# EAGLE design EAT0001 (EAGLE 7.2.0)
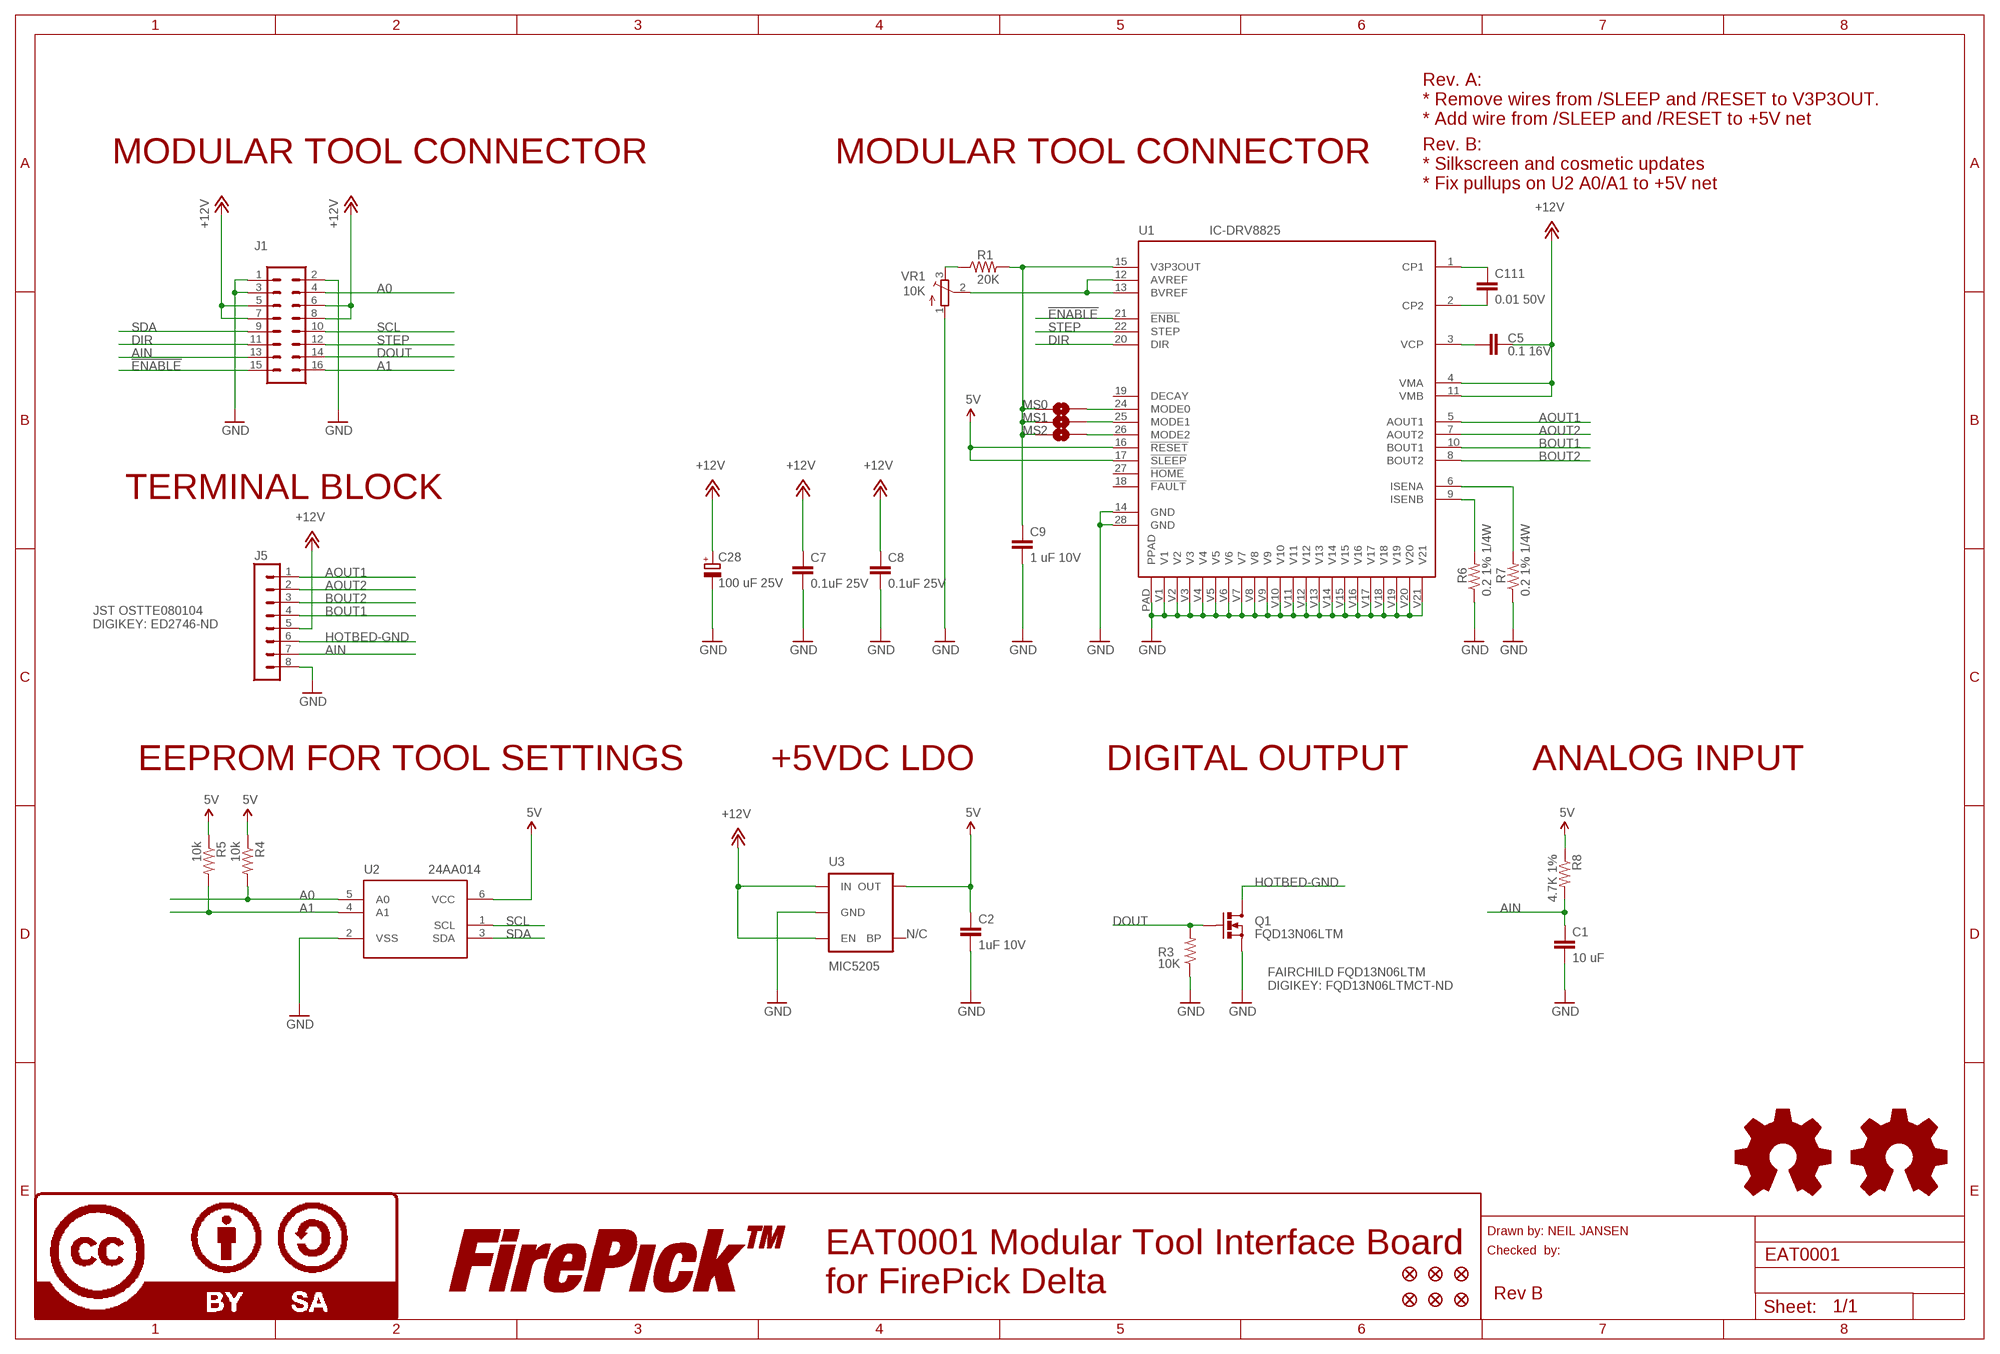
[diagram p0: schematic, sheet 1]

## Parts
C1  10 uF  CAP0805  [0805]
C2  1uF 10V  CAP0805  [0805]
C5  0.1 16V  CAP0805  [0805]
C7  0.1uF 25V  CAP0805  [0805]
C8  0.1uF 25V  CAP0805  [0805]
C9  1 uF 10V  CAP0805  [0805]
C28  100 uF 25V  CPOL-EUUD-6,3X7,7  [UD-6,3X7,7_NICHICON]
C111  0.01 50V  CAP0805  [0805]
FID1  FIDUCIAL1X2  [FIDUCIAL-1X2]
FID2  FIDUCIAL1X2  [FIDUCIAL-1X2]
FID3  FIDUCIAL1X2  [FIDUCIAL-1X2]
FID4  FIDUCIAL1X2  [FIDUCIAL-1X2]
FID5  FIDUCIAL1X2  [FIDUCIAL-1X2]
FID6  FIDUCIAL1X2  [FIDUCIAL-1X2]
J1  CONN-RECT-16PIN-2ROWSIDE  [CONN-RECT-2.54MM-16PIN-2ROW-SIDE]
J5  CONN-OSTTE1201X4  [CONN-OSTTE1201X4]
LOGO1  LOGO-OSHWSMALL  [LOGO-OSHW-SMALL]
LOGO4  LOGO-FIREPICKMEDIUM  [LOGO-FIREPICK-MEDIUM]
LOGO5  LOGO-OSHWSMALL  [LOGO-OSHW-SMALL]
LOGO6  LOGO-CC-BY-SAMEDIUM  [LOGO-CC-BY-SA-MEDIUM]
MS0  JUMPER  [JUMPER-NC]
MS1  JUMPER  [JUMPER-NC]
MS2  JUMPER  [JUMPER-NC]
Q1  FQD13N06LTM  MOSFET-NCHANNELFDD8580  [DPAK]
R1  20K  RESISTOR0805-RES  [0805]
R3  10K  RESISTOR0805-RES  [0805]
R4  10k  RESISTOR0805-RES  [0805]
R5  10k  RESISTOR0805-RES  [0805]
R6  0.2 1% 1/4W  RESISTOR0805-RES  [0805]
R7  0.2 1% 1/4W  RESISTOR0805-RES  [0805]
R8  4.7K 1%  RESISTOR0805-RES  [0805]
U1  IC-DRV8825  [TSSOP28_PAD]
U2  24AA014  IC-24AA014  [SOT23-6]
U3  MIC5205  MIC52055V  [SOT23-5]
VR1  10K  TRIMPOTTC33X  [TC33X]

## Nets
5V [power]: C2.1 R4.1 R5.1 R8.1 U1.16(!RESET) U1.17(!SLEEP) U2.6(VCC) U3.5(OUT)
!ENABLE: J1.15 U1.21(!ENBL)
+12V [power-12V]: C5.1 C7.1 C8.1 C28.+ J1.5 J1.6 J1.7 J1.8 J5.5 U1.4(VMA) U1.11(VMB) U3.1(IN) U3.3(EN)
A0: J1.4 R4.2 U2.5(A0)
A1: J1.16 R5.2 U2.4(A1)
AIN: C1.1 J1.13 J5.7 R8.2
AOUT1: J5.1 U1.5(AOUT1)
AOUT2: J5.2 U1.7(AOUT2)
BOUT1: J5.4 U1.10(BOUT1)
BOUT2: J5.3 U1.8(BOUT2)
CP1: C111.1 U1.1(CP1)
CP2: C111.2 U1.2(CP2)
DIR: J1.11 U1.20(DIR)
DOUT: J1.14 Q1.1(G) R3.2
GND: C1.2 C2.2 C7.2 C8.2 C9.2 C28.- J1.1 J1.2 J1.3 J5.8 Q1.3(S) R3.1 R6.1 R7.1 U1.14(GND) U1.28(GND) U1.PAD U1.V1 U1.V2 U1.V3 U1.V4 U1.V5 U1.V6 U1.V7 U1.V8 U1.V9 U1.V10 U1.V11 U1.V12 U1.V13 U1.V14 U1.V15 U1.V16 U1.V17 U1.V18 U1.V19 U1.V20 U1.V21 U2.2(VSS) U3.2(GND) VR1.1(A)
HOTBED-GND [power-12V]: J5.6 Q1.4(D)
ISENA: R7.2 U1.6(ISENA)
ISENB: R6.2 U1.9(ISENB)
MOD1: MS1.2 U1.25(MODE1)
MODE0: MS0.2 U1.24(MODE0)
MODE2: MS2.2 U1.26(MODE2)
N$3: R1.1 VR1.3(E)
SCL: J1.10 U2.1(SCL)
SDA: J1.9 U2.3(SDA)
STEP: J1.12 U1.22(STEP)
V3P3OUT [power]: C9.1 MS0.1 MS1.1 MS2.1 R1.2 U1.15(V3P3OUT)
VCP: C5.2 U1.3(VCP)
VREF: U1.12(AVREF) U1.13(BVREF) VR1.2(S)
Unconnected: U1.18(!FAULT) U1.19(DECAY) U1.27(!HOME) U3.4(BP)

## Notes on the sheet
- Rev. A: 
  * Remove wires from /SLEEP and /RESET to V3P3OUT.
  * Add wire from /SLEEP and /RESET to +5V net
- MODULAR TOOL CONNECTOR | MODULAR TOOL CONNECTOR
- Rev. B: 
  * Silkscreen and cosmetic updates
  * Fix pullups on U2 A0/A1 to +5V net
- TERMINAL BLOCK
- JST OSTTE080104
  DIGIKEY: ED2746-ND
- EEPROM FOR TOOL SETTINGS | +5VDC LDO | DIGITAL OUTPUT | ANALOG INPUT
- N/C
- FAIRCHILD FQD13N06LTM
  DIGIKEY: FQD13N06LTMCT-ND
- Drawn by: NEIL JANSEN
- Checked  by:
- EAT0001 Modular Tool Interface Board
  for FirePick Delta
- Rev B

## Library data of the parts
C1 C2 C5 C7-C9 C111 = SparkFun-Capacitors:CAP: Capacitor Standard 0603 ceramic capacitor, and 0.1" leaded capacitor.
C28 = rcl:CPOL-EU: POLARIZED CAPACITOR, European symbol
FID1-FID6 = SparkFun-Aesthetics:FIDUCIAL: Fiducial Alignment Points Various fiducial points for machine vision alignment.
J1 = FirePick:CONN-RECT-16PIN-2ROW
J5 = FirePick:CONN-OSTTE1201X4
LOGO1 LOGO5 = FirePick:LOGO-OSHW
LOGO4 = FirePick:LOGO-FIREPICK
LOGO6 = FirePick:LOGO-CC-BY-SA
MS0 MS1 MS2 = FirePick:JUMPER
Q1 = SparkFun:MOSFET-NCHANNEL
R1 R3-R8 = SparkFun-Resistors:RESISTOR: Resistor Basic schematic elements and footprints for 0603, 1206, and PTH resistors.
U1 = FirePick:IC-DRV8825
U2 = FirePick:IC-24AA014
U3 = SparkFun-PowerIC:MIC5205: MIC5205 150mA vreg 3.3V - VREG-00822 5V - VREG-00823; PROD_ID: VREG-00823
VR1 = adafruit:TRIMPOT: SMT trimmer potentiometer part number TC33X http://www.ladyada.net/library/eagle

## Net classes
0 default: width 0.3 mm, drill 0.3 mm, clearance 0.3 mm
1 power: width 0.3 mm, drill 0.3 mm, clearance 0.3 mm
2 power-12V: width 0.3 mm, drill 0.3 mm, clearance 0.3 mm

## Board
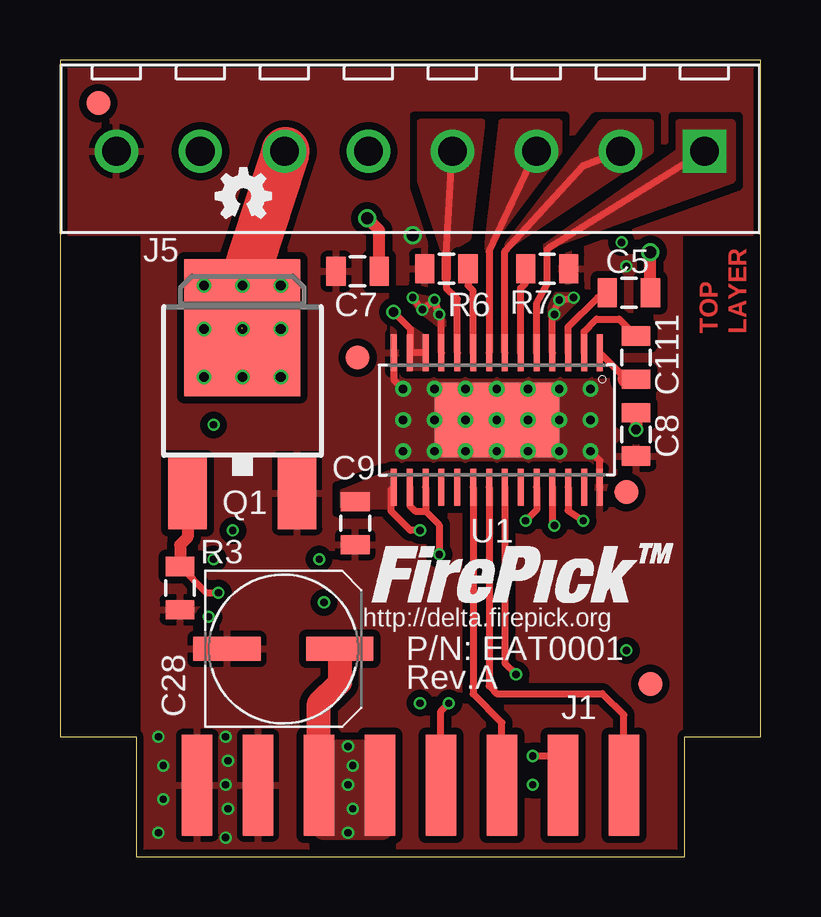
[diagram p1: board, top side]
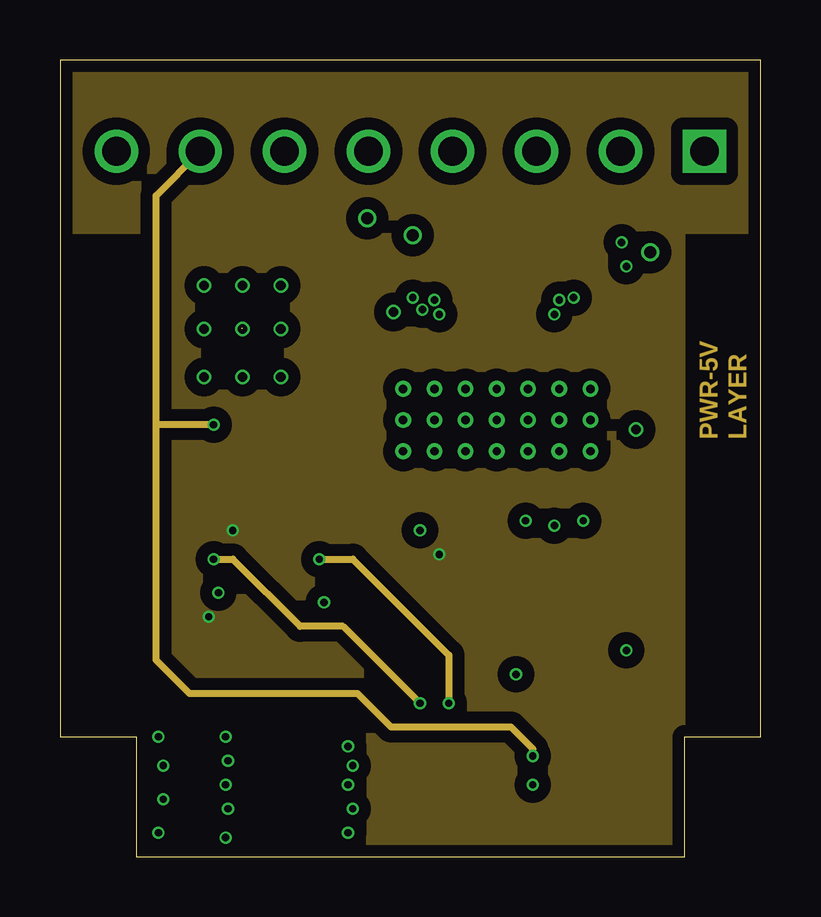
[diagram p2: board, inner layer PWR-5v]
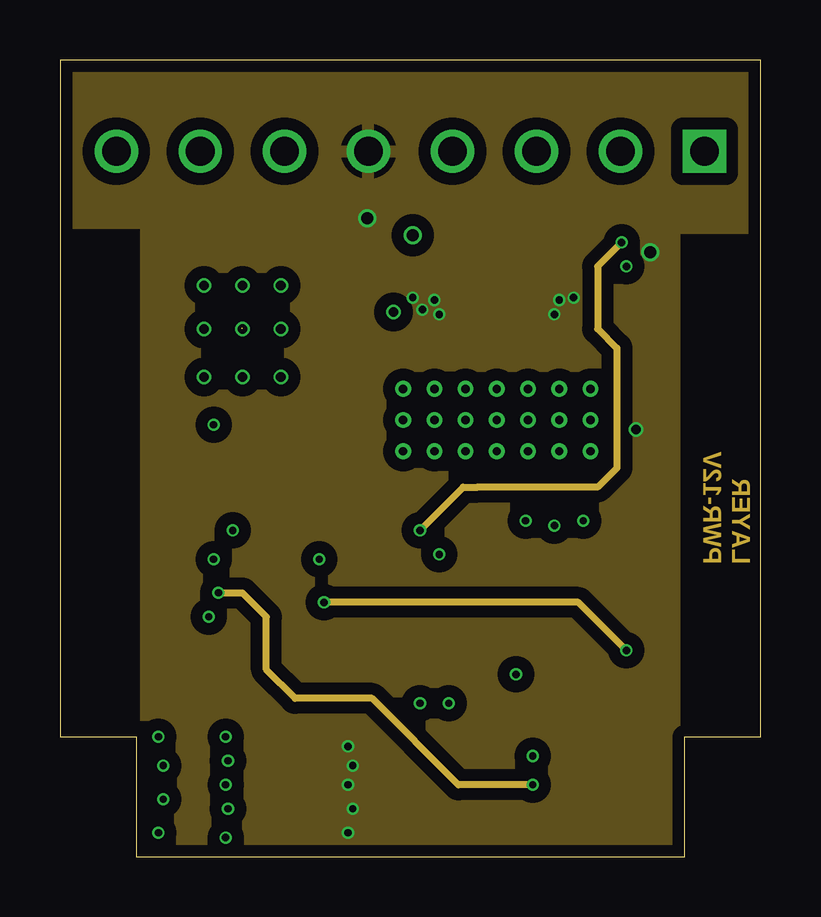
[diagram p3: board, inner layer PWR-12V]
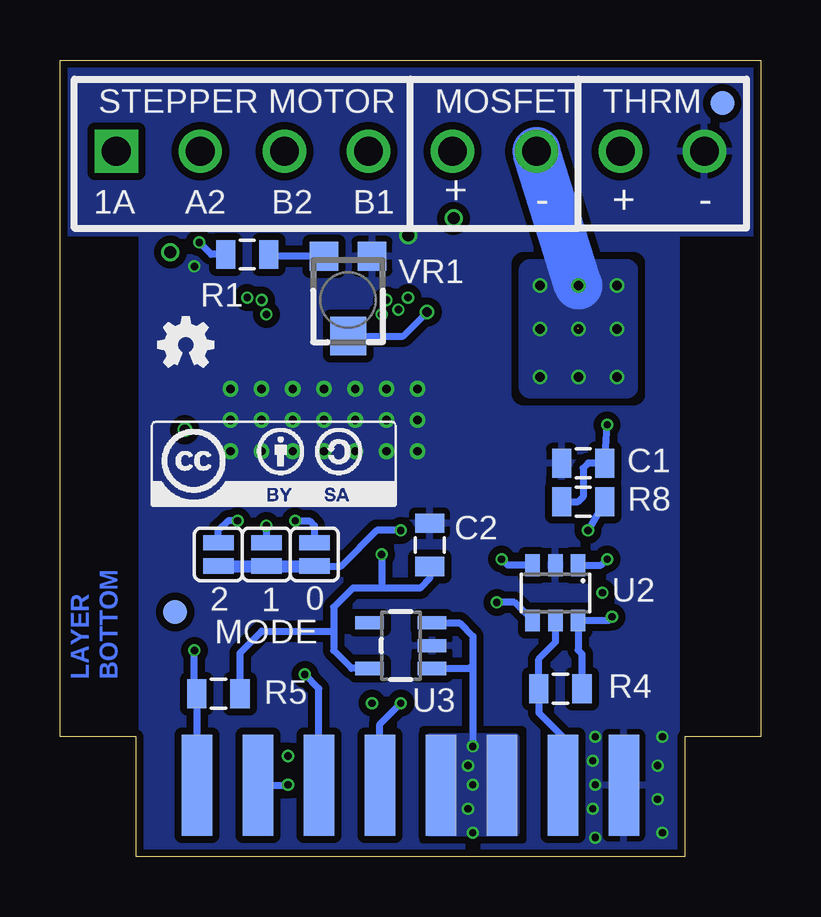
[diagram p4: board, bottom side, seen from below]

Size 29.2 x 33.2 mm. Coordinates in mm from the lower left corner, seen from the top.
Outline: 3.17,0 26.03,0 26.03,5 29.2,5 29.2,33.2 0,33.2 0,5 3.17,5 3.17,0
Copper layers (1*2*15*16): Top 0.035mm / dielectric 0.2mm / PWR-5v 0.0175mm / dielectric 0.3mm / PWR-12V 0.0175mm / dielectric 0.2mm / Bottom 0.035mm
Design rules "SeeedStudio_4layer_DRU_no_angle_20140221": minimum track width 8mil, minimum drill 12mil, track to track 8mil, track to pad 8mil, pad to pad 8mil, via to via 8mil, smd to smd 0mil, copper to edge 10mil, drill to drill 8mil, minimum pad ring 6mil, minimum via ring 4mil, stop-mask expansion 4mil, vias tented up to drill 100mil, thermal gap 10mil

### Footprints (pad centres in the part's own frame; a part is rotated, then mirrored left to right if it is on the bottom)
0805 = smd 0.8 x 1.2: 1 -0.9,0; 2 0.9,0
UD-6,3X7,7_NICHICON = smd 2.8 x 1: + 2.35,0; - -2.35,0
FIDUCIAL-1X2 = smd 1 x 1: 1 0,0
CONN-RECT-2.54MM-16PIN-2ROW-SIDE = smd 1.27 x 4.2: 1 -8.89,-0.02; 3 -6.35,-0.02; 5 -3.81,-0.02; 7 -1.27,-0.02; 9 1.27,-0.02; 11 3.81,-0.02; 13 6.35,-0.02; 15 8.89,-0.02 | smd 1.27 x 4.2 bottom: 2 -8.89,-0.02; 4 -6.35,-0.02; 6 -3.81,-0.02; 8 -1.27,-0.02; 10 1.27,-0.02; 12 3.81,-0.02; 14 6.35,-0.02; 16 8.89,-0.02
CONN-OSTTE1201X4 = drill 1.2 square: 1 -12.25,0 | drill 1.2: 2 -8.75,0; 3 -5.25,0; 4 -1.75,0; 5 1.75,0; 6 5.25,0; 7 8.75,0; 8 12.25,0
JUMPER-NC = smd 0.635 x 1.27: 1 -0.487,0; 2 0.487,0
DPAK = smd 1.6 x 3: 1 -2.28,-5.31; 3 2.28,-5.31 | smd 4.826 x 5.715: 4 0,1.588
TSSOP28_PAD = smd 1.55 x 0.25: 1 -2.8,4.298; 2 -2.8,3.637; 3 -2.8,2.977; 4 -2.8,2.317; 5 -2.8,1.656; 6 -2.8,0.996; 7 -2.8,0.335; 8 -2.8,-0.325; 9 -2.8,-0.985; 10 -2.8,-1.646; 11 -2.8,-2.306; 12 -2.8,-2.967; 13 -2.8,-3.627; 14 -2.8,-4.287; 15 2.8,-4.287; 16 2.8,-3.627; 17 2.8,-2.967; 18 2.8,-2.306; 19 2.8,-1.646; 20 2.8,-0.985; 21 2.8,-0.325; 22 2.8,0.335; 23 2.8,0.996; 24 2.8,1.656; 25 2.8,2.317; 26 2.8,2.977; 27 2.8,3.637; 28 2.8,4.298 | smd 3.1 x 5.18: PAD 0,0.005 | drill 0.35 pad 0.6: V1 -1.3,3.9; V2 0,3.9; V3 1.3,3.9; V4 -1.3,2.6; V5 0,2.6; V6 1.3,2.6; V7 -1.3,1.3; V8 0,1.3; V9 1.3,1.3; V10 -1.3,0; V11 0,0; V12 1.3,0; V13 -1.3,-1.3; V14 0,-1.3; V15 1.3,-1.3; V16 -1.3,-2.6; V17 0,-2.6; V18 1.3,-2.6; V19 -1.3,-3.9; V20 0,-3.9; V21 1.3,-3.9
SOT23-6 = smd 0.6 x 0.9: 1 -0.95,-1.15; 2 0,-1.15; 3 0.95,-1.15; 4 0.95,1.15; 5 0,1.15; 6 -0.95,1.15
SOT23-5 = smd 0.55 x 1.2: 1 -0.95,-1.3; 2 0,-1.3; 3 0.95,-1.3; 4 0.95,1.3; 5 -0.95,1.3
TC33X = smd 1.2 x 1.2: 1 -1,-1.825; 3 1,-1.825 | smd 1.5 x 1.6: 2 0,1.5

### Placement (x,y rotation side)
C1  7.4,16.4 180 bottom
C2  13.8,13 90 bottom
C5  23.7,23.5 180 top
C7  12.4,24.4 180 top
C8  24,17.6 270 top
C9  12.3,13.9 270 top
C28  9.31,8.66 0 top
C111  24,20.8 90 top
FID1  23.6,15.2 0 top
FID2  12.4,20.8 0 top
FID3  1.6,31.4 0 top
FID4  24.6,7.2 90 top
FID5  24.4,10.2 0 bottom
FID6  1.6,31.4 0 bottom
J1  14.6,3 0 top
J5  14.6,29.4 180 top
LOGO1  6.4,26.4 0 top
LOGO4  13,10.6 0 top
LOGO5  25.2,20.2 0 bottom
LOGO6  25.4,14.6 0 bottom
MS0  18.6,12.6 90 bottom
MS1  20.6,12.6 90 bottom
MS2  22.6,12.6 90 bottom
Q1  7.6,20.46 0 top
R1  21.4,25.1 180 bottom
R3  5,11.2 90 top
R4  8.35,7 180 bottom
R5  22.6,6.8 180 bottom
R6  16.1,24.5 0 top
R7  20.3,24.5 180 top
R8  7.4,14.8 180 bottom
U1  18.2,18.2 270 top
U2  8.56,11 180 bottom
U3  15,8.8 90 bottom
VR1  17.2,23.2 180 bottom

### Tracks (layer width: path | path; a pad name or v marks a point on that pad's centre or on a via)
5V  (via drill 0.3)
  Top 0.3: v15.8,12.6 15.8,13.83 15.23,14.4 | U1.17 15.23,14.4 | U1.16 14.57,14.63 14.8,14.4 15.23,14.4
  Bottom 0.3: R8.1 v7.2,13.6 | C2.1 13.8,11.6 14.2,11.2 15.8,11.2 | 15.8,11.2 17,11.2 17.8,10.4 17.8,9.45 | 17.8,9.45 17.8,8.6 17.05,7.85 U3.5 | v6.2,10 6.35,9.85 U2.6 7.61,8.61 7.45,8.45 R4.1 | v15.8,12.6 15.8,11.2 | R5.1 21.7,8.5 20.8,9.4 17.85,9.4 17.8,9.45
  pour PWR-5v (isolate 0.5): 0.2,33 29,33 29,26.2 25.8,26.2 25.8,0 3.4,0 3.4,26.2 0.2,26.2
!ENABLE
  Top 0.3: U1.21 17.88,7.12 18.2,6.8 22.6,6.8 23.49,5.91 J1.15
+12V  (via drill 0.3, 0.4, 0.5)
  Top 0.3: U1.11 15.89,22.51 v15.8,22.6 v15.6,23.2 v15.1,22.8 v14.7,23.3 | U1.4 20.52,22.52 v20.8,23.2 v21.4,23.3
  Top 0.5: C5.1 v24.6,25.2 | C7.1 13.3,26.1 v12.8,26.6 | C8.1 v24,17.8
  Top 1: J1.6 10.79,6.39 11.66,7.26 C28.+
  Bottom 0.3: U3.3 12.55,9.75 12,9.2 12,8 | 12,8 v12,4.6 | U3.1 12.15,7.85 12,8
  other vias: 12,3 12.2,2 12,1 12.2,3.8 20.6,22.6
  pour Top (isolate 0.3, no thermals): 11,4.4 13.4,4.4 13.4,1.2 11,1.2
  pour PWR-12V (isolate 0.5, rank 2): 0.2,33 29,33 29,26.2 25.6,26.2 25.6,0.2 3.6,0.2 3.6,26.4 0.2,26.4
  pour Bottom (no thermals): 10.2,5 13.8,5 13.8,1 10.2,1
  pour Top (no thermals): 14.6,23.4 15.6,23.2 16,22.2 15.8,22.2 15,22.8
  pour Top (no thermals): 20.6,23.4 21.4,23.4 21.6,23 20.6,22.4 20.4,22.6
A0
  Bottom 0.3: J1.4 8.25,5 9.25,6 R4.2 9.25,8.25 8.56,8.94 U2.5
A1  (via drill 0.3)
  PWR-12V 0.3: v23.6,8.6 21.6,10.6 v11,10.6
  Bottom 0.3: J1.16 R5.2 23.6,6.9 v23.6,8.6 | U2.4 10.26,10.6 v11,10.6
AIN  (via drill 0.3)
  Top 0.3: J1.13 20.95,4.15 21,4.2 v19.7,4.2
  PWR-5v 0.3: 4,18 4,8.2 5.4,6.8 12.4,6.8 13.8,5.4 18.8,5.4 19.7,4.5 v19.7,4.2 | 4,18 4,27.55 J5.7 | v6.4,18 4,18
  Bottom 0.3: R8.2 7.6,14.8 7.4,15 7.4,16.2 7.2,16.4 C1.1 v6.4,18
AOUT1
  Top 0.3: U1.5 19.86,23.06 20.3,23.85 20.3,25.3 20.4,25.4 J5.1
  pour Top (no thermals): 28,30.6 28,28.2 20.2,25.4 25.8,29.4 25.8,30.6
AOUT2
  Top 0.3: U1.7 18.54,25.23 21.8,28.8 J5.2
  pour Top (no thermals): 24.6,29.4 18.6,25.4 22.6,30.6 24.6,30.6
BOUT1
  Top 0.3: U1.10 16.55,23.25 16.1,23.7 16.1,24.1 | 16.1,25.1 J5.4
  Top 0.4: 16.1,24.1 16.1,25.1
  pour Top (no thermals): 17.6,30.6 15,30.6 15,28.2 16,25.2 17,25.8
BOUT2
  Top 0.3: U1.8 17.88,25.23 J5.3
  pour Top (no thermals): 20.8,30.6 18.4,30.6 17.8,25.4 20.8,29.4
CP1
  Top 0.3: 23.6,19.9 U1.1
  Top 0.75: C111.1 23.6,19.9
CP2
  Top 0.3: U1.2 21.84,21.89 22.35,22.4 23.3,22.4 C111.2
DIR
  Top 0.3: U1.20 17.21,6.79 18.41,5.59 J1.11
DOUT  (via drill 0.3)
  Top 0.3: R3.2 6.1,11 v6.6,11
  Top 0.5: Q1.1 5.32,13.32 5,13 R3.2
  PWR-12V 0.3: v6.6,11 7.6,11 8.6,10 8.6,7.8 9.8,6.6 13,6.6 16.6,3 v19.7,3
  Bottom 0.3: J1.14 19.82,2.98 v19.7,3
GND  (via drill 0.3, 0.5)
  Top 0.3: U1.14 13.91,19.89 U1.V19 | U1.28 22.5,16.5 U1.V3
  other vias: 14.7,25.9 6.9,5 4.3,3.8 6.9,3 7,2 6.9,0.8 23.6,24.6 7,4 4.1,1 4.3,2.4 4.1,5
  pour Top (isolate 0.3, rank 2): 0,33 29.1,33 29.1,26 25.8,26 25.8,0 3.5,0 3.5,26 0,26
  pour Bottom (isolate 0.3, rank 2): 29.1,33 29.1,26 25.8,26 25.8,0.2 3.5,0.2 3.5,26 0,26 0,33
  pour Bottom (no thermals): 13.6,20.8 23,20.4 23,16 13.6,16
  pour Top (no thermals): 13.4,19.8 22.8,19.8 22.8,16.6 13.4,16.6
HOTBED-GND  (via drill 0.4)  (1 unrouted)
  Top 2: 9.4,29.4 v7.6,23.8
  Bottom 2: v7.6,23.8 J5.6
  other vias: 6,23.8 9.2,23.8 9.2,20 6,20 7.6,22 6,22 9.2,22 7.6,20
  pour Bottom (isolate 0.5): 9.6,24.4 9.6,19.6 5.6,19.6 5.6,24.4
ISENA
  Top 0.3: U1.6 19.2,23.7 19.4,23.9 19.4,24.3
  Top 0.4: R7.2 19.4,24.3
ISENB
  Top 0.3: U1.9 17.21,23.59 17,23.8 R6.2
MOD1  (via drill 0.3)
  Top 0.3: U1.25 20.52,13.88 v20.6,13.8
  Bottom 0.3: v20.6,13.8 MS1.2
MODE0  (via drill 0.3)
  Top 0.3: U1.24 19.86,14.46 v19.4,14
  Bottom 0.3: v19.4,14 18.8,14 18.6,13.8 MS0.2
MODE2  (via drill 0.3)
  Top 0.3: U1.26 21.18,14.42 v21.8,14
  Bottom 0.3: v21.8,14 22.2,14 22.6,13.6 MS2.2
N$3
  Bottom 0.3: VR1.3 20.43,25.02 R1.1
SCL  (via drill 0.3)
  PWR-5v 0.3: v15,6.4 11.8,9.6 10,9.6 7.2,12.4 v6.4,12.4
  Bottom 0.3: J1.10 15.87,5.53 v15,6.4 | U2.1 6.65,12.15 v6.4,12.4
SDA  (via drill 0.3)
  Top 0.3: J1.9 15.87,6.07 v16.2,6.4
  PWR-5v 0.3: v10.8,12.4 12.2,12.4 16.2,8.4 v16.2,6.4
  Bottom 0.3: U2.3 10.55,12.15 v10.8,12.4
STEP  (via drill 0.3)
  Top 0.3: U1.22 18.54,8.06 v19,7.6
  Bottom 0.3: J1.12 18.41,7.01 v19,7.6
V3P3OUT  (via drill 0.3)
  Top 0.254: 13.8,15.31 U1.15
  Top 0.3: v15,13.6 14.6,13.6 13.8,14.4 13.8,15.31
  PWR-12V 0.3: v23.4,25.6 22.4,24.6 22.4,22 23.2,21.2 23.2,16.2 22.4,15.4 17.4,15.4 16.8,15.4 v15,13.6
  Bottom 0.3: MS0.1 17.49,12.11 16,13.6 v15,13.6 | R1.2 22.9,25.1 v23.4,25.6
  Bottom 0.5: MS2.1 MS1.1 MS0.1
  pour Top (no thermals): 11.8,15.2 13.8,16 13.8,14.6 11.8,14.6
VCP
  Top 0.3: U1.3 21.18,22.08 22.4,23.3 C5.2
VREF  (via drill 0.4)
  Top 0.3: U1.12 14.6,21 | 14.6,21 U1.13 | v13.9,22.7 14.6,22 14.6,21
  Bottom 0.3: VR1.2 14.9,21.7 v13.9,22.7
  pour Top (no thermals): 14.6,22 14.6,20.4 15.2,20.4 15.2,21.6

### Text on the board
Top: TOP | LAYER
PWR-5v: PWR-5V | LAYER
PWR-12V: PWR-12V | LAYER
Bottom: BOTTOM | LAYER
tPlace: http://delta.firepick.org | P/N: EAT0001 | Rev.A
bPlace: THRM | MOSFET | STEPPER MOTOR | - | + | - | + | B1 | B2 | A2 | 1A | 0 | 1 | 2 | MODE